# EAGLE design Orthogon - driver + pixels (EAGLE 8.7.1)
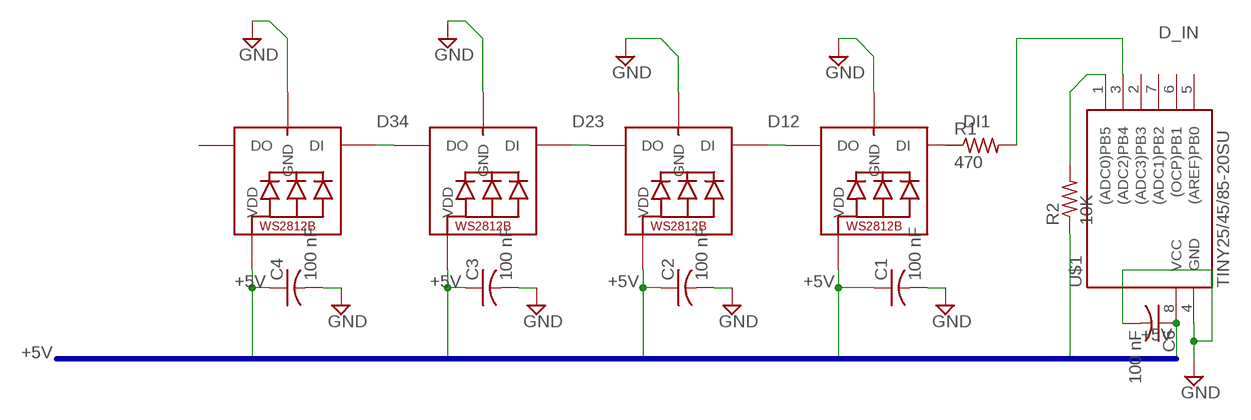
[diagram p0: schematic, sheet 1]

## Parts
C1  100 nF  C-USC0402  [C0402]
C2  100 nF  C-USC0402  [C0402]
C3  100 nF  C-USC0402  [C0402]
C4  100 nF  C-USC0402  [C0402]
C6  100 nF  C-USC0402  [C0402]
LED2  WS2812B3535  [LED3535]
LED3  WS2812B3535  [LED3535]
LED4  WS2812B3535  [LED3535]
LED5  WS2812B3535  [LED3535]
R1  470  R-US_R0402  [R0402]
R2  10K  R-US_R0402  [R0402]
U$1  TINY25/45/85-20SU  [SOIC8]

## Nets
+5V [+5V]: C1.1 C2.1 C3.1 C4.1 C6.1 LED2.2(VDD) LED3.2(VDD) LED4.2(VDD) LED5.2(VDD) R2.1 R2.2 U$1.1((ADC0)PB5) U$1.8(VCC)
D12 [Signal]: LED4.1(DI) LED5.3(DO)
D23 [Signal]: LED3.1(DI) LED4.3(DO)
D34 [Signal]: LED2.1(DI) LED3.3(DO)
D_IN: R1.2 U$1.3((ADC2)PB4)
DI1 [Signal]: LED5.1(DI) R1.1
GND [GND]: C1.2 C2.2 C3.2 C4.2 C6.2 LED2.4(GND) LED3.4(GND) LED4.4(GND) LED5.4(GND) U$1.4(GND)
Unconnected: LED2.3(DO) U$1.2((ADC3)PB3) U$1.5((AREF)PB0) U$1.6((OCP)PB1) U$1.7((ADC1)PB2)

## Buses
+5V

## Library data of the parts
C1-C4 C6 = resistor:C-US: CAPACITOR, American symbol
LED2-LED5 = adafruit:WS2812B
R1 R2 = resistor:R-US_: RESISTOR, American symbol
U$1 = avr-7:TINY25/45/85

## Net classes
1 Signal: width 0.25 mm, drill 0.4 mm, clearance 0.4 mm
2 +5V: width 0.5 mm, drill 0.4 mm, clearance 0.4 mm
5 CLEAR: width 0.1 mm, drill 0.4 mm, clearance 1.5 mm

## Board
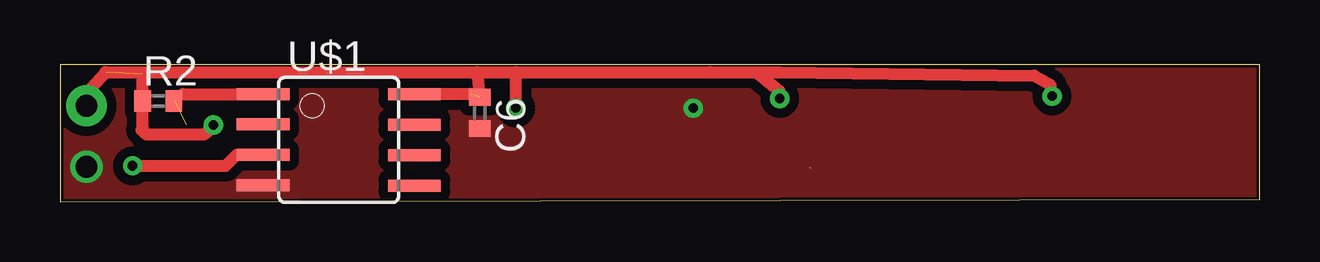
[diagram p1: board, top side]
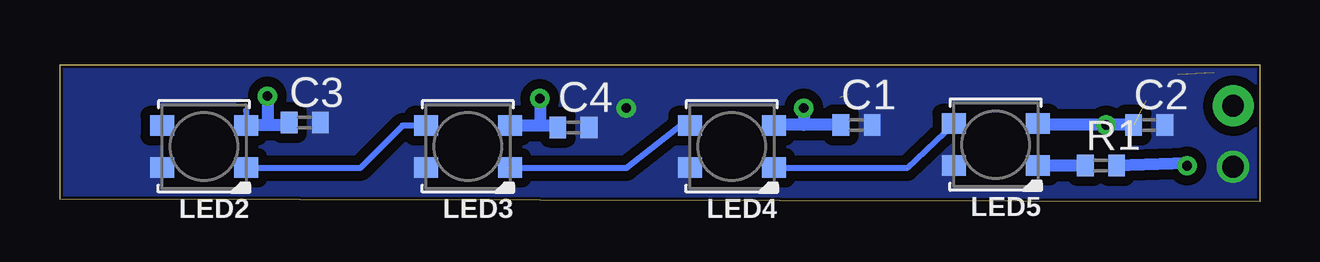
[diagram p2: board, bottom side, seen from below]

Size 50 x 5.7 mm. Coordinates in mm from the lower left corner, seen from the top.
Outline: 0,0 50,0.1 50,5.7 0,5.7 0,0
Copper layers (1*16): Top 0.035mm / dielectric 1.5mm / Bottom 0.035mm
Design rules "default *": minimum track width 0.25mm, minimum drill 0.4mm, track to track 0.4mm, track to pad 0.4mm, pad to pad 0.4mm, via to via 0.4mm, smd to smd 0.4mm, copper to edge 0.1mm, drill to drill 0.1mm, minimum pad ring 10mil, minimum via ring 8mil, stop-mask expansion 4mil, vias tented up to drill 0mil, thermal gap 10mil

### Footprints (pad centres in the part's own frame; a part is rotated, then mirrored left to right if it is on the bottom)
C0402 = smd 0.7 x 0.9: 1 -0.65,0; 2 0.65,0
LED3535 = smd 1 x 0.85: 1 -1.75,0.875; 2 -1.75,-0.875; 3 1.75,-0.875; 4 1.75,0.875
R0402 = smd 0.7 x 0.9: 1 -0.65,0; 2 0.65,0
SOIC8 = smd 0.5 x 2.2: 1 -1.905,-3.154; 2 -0.645,-3.154; 3 0.625,-3.154; 4 1.895,-3.154; 5 1.905,3.154; 6 0.635,3.154; 7 -0.635,3.154; 8 -1.905,3.154

### Placement (x,y rotation side)
C1  16.8,3.2 0 bottom
C2  4.6,3.2 0 bottom
C3  39.8,3.3 0 bottom
C4  28.6,3.1 0 bottom
C6  17.5,3.7 270 top
LED2  44,2.3 180 bottom
LED3  33,2.3 180 bottom
LED4  22,2.3 180 bottom
LED5  11,2.38 180 bottom
R1  6.61,1.51 0 bottom
R2  4.1,4.2 0 top
U$1  11.62,2.58 270 top

### Tracks (layer width: path | path; a pad name or v marks a point on that pad's centre or on a via)
+5V  (via drill 0.4, 0.9 pad 1.7)  (3 unrouted)
  Top 0.102: 41.45,4.7 v41.35,4.4
  Top 0.152: v1.1,4 1.8,4 | R2.2 5.13,4.49
  Top 0.254: 41.3,4.85 41.3,4.61 | 30,4.59 v30,4.3
  Top 0.5: 40.6,5.25 30,5.39 29,5.39 27.1,5.4 19,5.4 17.4,5.4 1.9,5.4 1.1,4.5 v1.1,4 | 41.3,4.61 v41.35,4.4
  Top 0.508: 40.6,5.25 41.3,4.85 | v19,3.9 19,5.4 | 29,5.39 30,4.59 | C6.1 17.4,5.4 | 17.16,4.49 U$1.8 | 5.13,4.49 U$1.1 | v6.4,3.2 6,2.8 3.6,2.8 3.4,3 3.45,3.05 R2.1 3.45,5.27 3.4,5.32
  Bottom 0.152: 9.2,3.2 LED5.2
  Bottom 0.254: 42.25,3.8 42.25,3.2 LED2.2 | 40.45,3.2 C3.1 | C4.1 29.25,3.18 | 20.25,3.2 LED4.2
  Bottom 0.508: 42.25,3.2 41.35,3.2 | 41.35,3.2 40.45,3.2 | 29.25,3.18 30,3.18 | 30,3.18 LED3.2 | v30,4.3 30,3.18 | v41.35,4.4 41.35,3.2 | C1.1 19,3.2 | 19,3.2 20.25,3.2 | v19,3.9 19,3.2 | C2.1 v6.4,3.2 9.2,3.2
CLEAR
  cutout Bottom (no thermals): 9.25,0.75 12.65,0.75 12.65,4.1 9.3,4.1 9.25,4.15
  cutout Bottom (no thermals): 20.25,0.65 23.65,0.65 23.65,4 20.3,4 20.25,4.05
  cutout Bottom (no thermals): 31.25,0.65 34.65,0.65 34.65,4 31.3,4 31.25,4.05
  cutout Bottom (no thermals): 42.25,0.65 45.65,0.65 45.65,4 42.3,4 42.25,4.05
D12  (1 unrouted)
  Bottom 0.254: LED5.3 14.7,1.41 | 14.7,1.4 20.23,1.4 LED4.1
D23  (1 unrouted)
  Bottom 0.25: 26.4,1.4 24,3.3
  Bottom 0.254: 26.4,1.4 31.3,1.4 | 24,3.3 23.88,3.18 LED4.3
D34
  Bottom 0.254: LED3.3 35.73,3.18 37.5,1.4 42.23,1.4 LED2.1
D_IN  (via drill 0.4 pad 0.8)
  Top 0.152: 8.31,1.9 U$1.3
  Top 0.508: v3.03,1.5 6.9,1.5 7.36,1.95 U$1.3
  Bottom 0.152: v3.03,1.5 3.04,1.61
  Bottom 0.508: 3.04,1.61 R1.2
DI1
  Bottom 0.254: 9.14,1.61 LED5.1 9,1.25 9,1.5 | R1.1 7.37,1.5
  Bottom 0.508: 7.37,1.5 9,1.5
GND  (via drill 0.4, 0.9)
  other vias: 1.1,1.46 26.4,3.9
  pour Bottom (no thermals): 0.1,-0.2 55.2,0.1 55.2,5.9 0.1,5.9
  pour Top (no thermals): -0.6,-1.1 57.4,-1.1 56.4,-0.1 56.4,6.7 -0.6,6.7